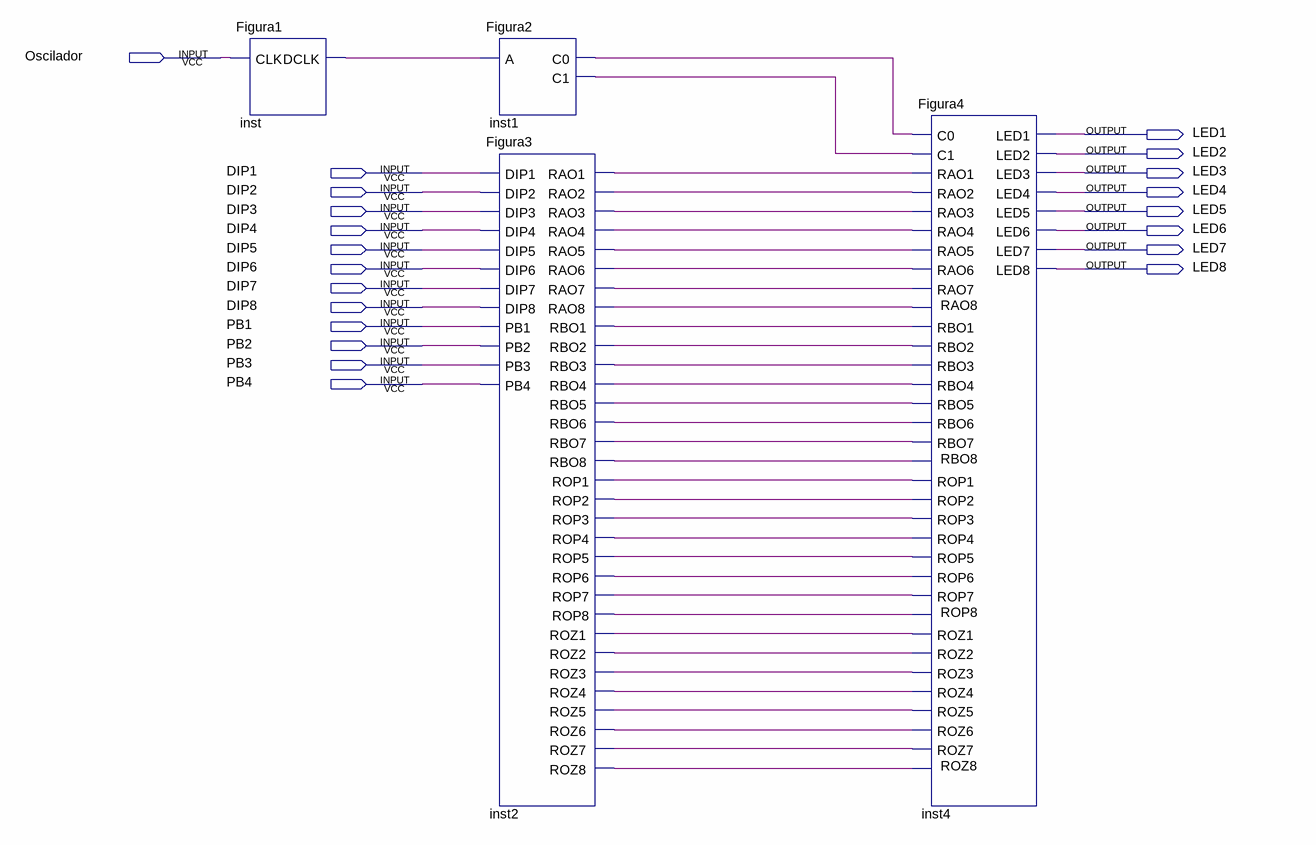
[diagram p0: schematic sheet]
// Quartus schematic Roteiro5.bdf as structural Verilog: 4 symbols, 21 pins
module Roteiro5 (
  input  Oscilador,
  input  DIP1,
  input  DIP2,
  input  DIP3,
  input  DIP4,
  input  DIP5,
  input  DIP6,
  input  DIP7,
  input  DIP8,
  input  PB1,
  input  PB2,
  input  PB3,
  input  PB4,
  output LED1,
  output LED2,
  output LED3,
  output LED4,
  output LED5,
  output LED6,
  output LED7,
  output LED8
);

  wire inst1_c0, inst1_c1, inst2_rao1, inst2_rao2, inst2_rao3, inst2_rao4, inst2_rao5, inst2_rao6,
       inst2_rao7, inst2_rao8, inst2_rbo1, inst2_rbo2, inst2_rbo3, inst2_rbo4, inst2_rbo5, inst2_rbo6,
       inst2_rbo7, inst2_rbo8, inst2_rop1, inst2_rop2, inst2_rop3, inst2_rop4, inst2_rop5, inst2_rop6,
       inst2_rop7, inst2_rop8, inst2_roz1, inst2_roz2, inst2_roz3, inst2_roz4, inst2_roz5, inst2_roz6,
       inst2_roz7, inst2_roz8, inst_dclk;

  Figura1 inst (.CLK(Oscilador), .DCLK(inst_dclk));
  Figura2 inst1 (.A(inst_dclk), .C0(inst1_c0), .C1(inst1_c1));
  Figura3 inst2 (
    .DIP1(DIP1), .DIP2(DIP2), .DIP3(DIP3), .DIP4(DIP4), .DIP5(DIP5), .DIP6(DIP6), .DIP7(DIP7), .DIP8(DIP8),
    .PB1(PB1), .PB2(PB2), .PB3(PB3), .PB4(PB4), .RAO1(inst2_rao1), .RAO2(inst2_rao2), .RAO3(inst2_rao3),
    .RAO4(inst2_rao4), .RAO5(inst2_rao5), .RAO6(inst2_rao6), .RAO7(inst2_rao7), .RAO8(inst2_rao8),
    .RBO1(inst2_rbo1), .RBO2(inst2_rbo2), .RBO3(inst2_rbo3), .RBO4(inst2_rbo4), .RBO5(inst2_rbo5),
    .RBO6(inst2_rbo6), .RBO7(inst2_rbo7), .RBO8(inst2_rbo8), .ROP1(inst2_rop1), .ROP2(inst2_rop2),
    .ROP3(inst2_rop3), .ROP4(inst2_rop4), .ROP5(inst2_rop5), .ROP6(inst2_rop6), .ROP7(inst2_rop7),
    .ROP8(inst2_rop8), .ROZ1(inst2_roz1), .ROZ2(inst2_roz2), .ROZ3(inst2_roz3), .ROZ4(inst2_roz4),
    .ROZ5(inst2_roz5), .ROZ6(inst2_roz6), .ROZ7(inst2_roz7), .ROZ8(inst2_roz8));
  Figura4 inst4 (
    .C0(inst1_c0), .C1(inst1_c1), .RAO1(inst2_rao1), .RBO1(inst2_rbo1), .ROP1(inst2_rop1), .ROZ1(inst2_roz1),
    .RAO2(inst2_rao2), .RBO2(inst2_rbo2), .ROP2(inst2_rop2), .ROZ2(inst2_roz2), .RAO3(inst2_rao3),
    .RBO3(inst2_rbo3), .ROP3(inst2_rop3), .ROZ3(inst2_roz3), .RAO4(inst2_rao4), .RBO4(inst2_rbo4),
    .ROP4(inst2_rop4), .ROZ4(inst2_roz4), .RAO5(inst2_rao5), .RBO5(inst2_rbo5), .ROP5(inst2_rop5),
    .ROZ5(inst2_roz5), .RAO6(inst2_rao6), .RBO6(inst2_rbo6), .ROP6(inst2_rop6), .ROZ6(inst2_roz6),
    .RAO7(inst2_rao7), .RBO7(inst2_rbo7), .ROP7(inst2_rop7), .ROZ7(inst2_roz7), .RAO8(inst2_rao8),
    .RBO8(inst2_rbo8), .ROP8(inst2_rop8), .ROZ8(inst2_roz8), .LED1(LED1), .LED2(LED2), .LED3(LED3),
    .LED4(LED4), .LED5(LED5), .LED6(LED6), .LED7(LED7), .LED8(LED8));
endmodule
